# EAGLE schematic gardtec (EAGLE 9.6.2)
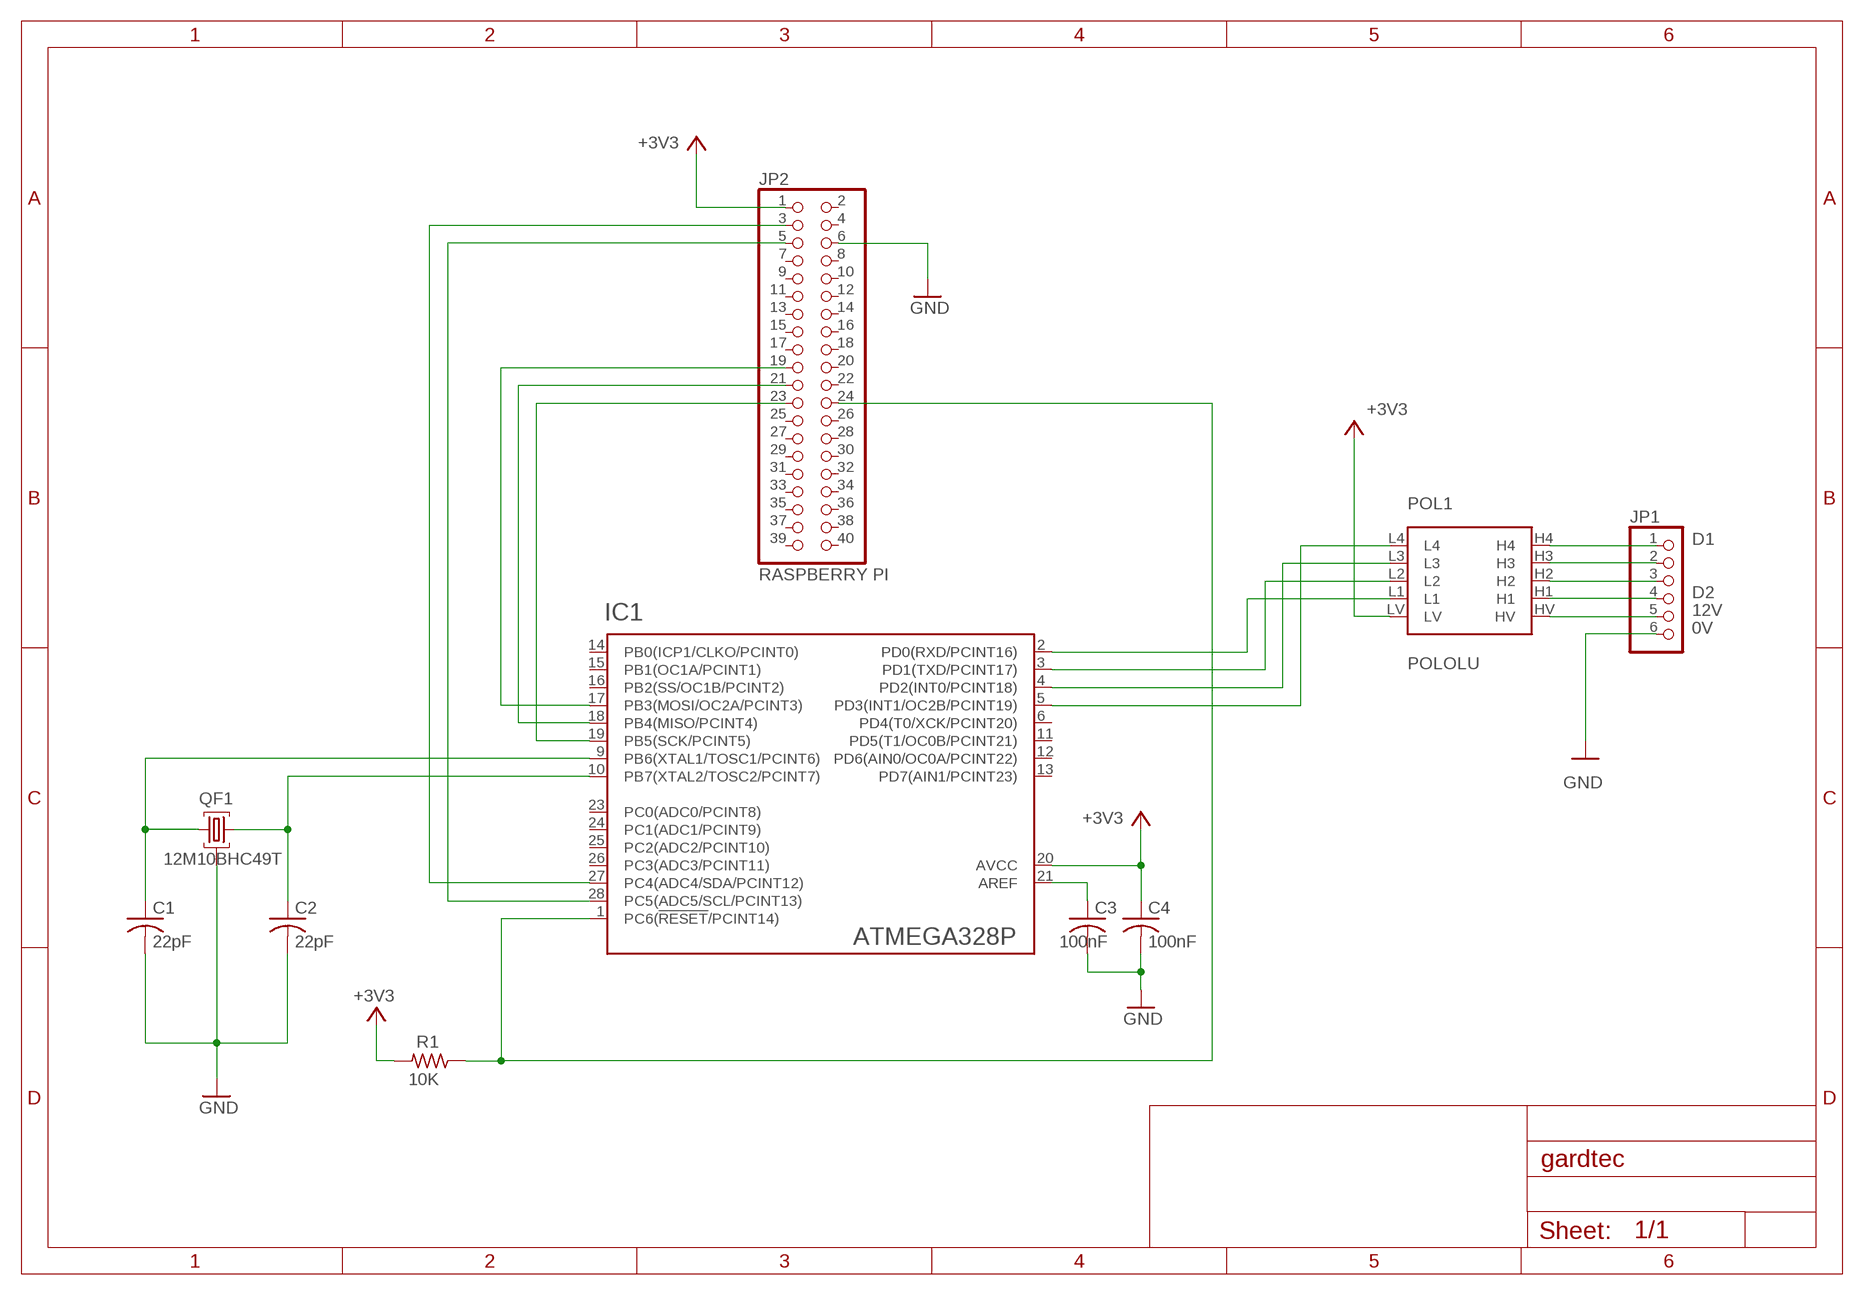
[diagram p0: schematic, sheet 1]

## Parts
C1  22pF  C-USC0805  [C0805]
C2  22pF  C-USC0805  [C0805]
C3  100nF  C-USC0805  [C0805]
C4  100nF  C-USC0805  [C0805]
IC1  ATMEGA328P  ATMEGA48/88/168/328-PU(DIP28)PU  [DIL28]
JP1  PINHD-1X6  [1X06]
JP2  RASPBERRY PI  PINHD-2X20  [2X20]
POL1  POLOLU  [POLOLU]
QF1  12M10BHC49T  [HC49U]
R1  10K  R-US_R0805  [R0805]

## Nets
0V: C1.2 C2.2 C3.2 C4.2 JP1.6 QF1.2 ; supply symbol labelled GND
12V: JP1.5 POL1.HV
+3V3: C4.1 IC1.20(AVCC) JP2.1 POL1.LV R1.2
D1: JP1.1 POL1.H4
D2: JP1.4 POL1.H1
GND: JP2.6
N$1: IC1.2(PD0(RXD/PCINT16)) POL1.L1
N$2: IC1.3(PD1(TXD/PCINT17)) POL1.L2
N$3: IC1.4(PD2(INT0/PCINT18)) POL1.L3
N$4: IC1.5(PD3(INT1/OC2B/PCINT19)) POL1.L4
N$5: C3.1 IC1.21(AREF)
N$7: C1.1 IC1.9(PB6(XTAL1/TOSC1/PCINT6)) QF1.1
N$8: C2.1 IC1.10(PB7(XTAL2/TOSC2/PCINT7)) QF1.3
N$9: IC1.1(PC6(!RESET!/PCINT14)) JP2.24 R1.1
N$11: JP1.2 POL1.H3
N$17: IC1.27(PC4(ADC4/SDA/PCINT12)) JP2.3
N$18: IC1.28(PC5(ADC5/SCL/PCINT13)) JP2.5
N$28: IC1.17(PB3(MOSI/OC2A/PCINT3)) JP2.19
N$29: IC1.19(PB5(SCK/PCINT5)) JP2.23
N$30: IC1.18(PB4(MISO/PCINT4)) JP2.21
N/C: JP1.3 POL1.H2
Unconnected: IC1.6(PD4(T0/XCK/PCINT20)) IC1.11(PD5(T1/OC0B/PCINT21)) IC1.12(PD6(AIN0/OC0A/PCINT22)) IC1.13(PD7(AIN1/PCINT23)) IC1.14(PB0(ICP1/CLKO/PCINT0)) IC1.15(PB1(OC1A/PCINT1)) IC1.16(PB2(SS/OC1B/PCINT2)) IC1.23(PC0(ADC0/PCINT8)) IC1.24(PC1(ADC1/PCINT9)) IC1.25(PC2(ADC2/PCINT10)) IC1.26(PC3(ADC3/PCINT11)) JP2.2 JP2.4 JP2.7 JP2.8 JP2.9 JP2.10 JP2.11 JP2.12 JP2.13 JP2.14 JP2.15 JP2.16 JP2.17 JP2.18 JP2.20 JP2.22 JP2.25 JP2.26 JP2.27 JP2.28 JP2.29 JP2.30 JP2.31 JP2.32 JP2.33 JP2.34 JP2.35 JP2.36 JP2.37 JP2.38 JP2.39 JP2.40

## Power pins joined to a net without a drawn wire
GND: IC1.8(GND) IC1.22(GND)
UCC: IC1.7(UCC)

## Library data of the parts
C1-C4 = rcl:C-US: CAPACITOR, American symbol; SPICEPREFIX: C
IC1 = atmel_tiny24-44-84tiny48-88mega48-88-168-328:ATMEGA48/88/168/328-PU(DIP28)
JP1 = pinhead:PINHD-1X6: PIN HEADER
JP2 = pinhead:PINHD-2X20: PIN HEADER
POL1 = level-shifter2:POLOLU
QF1 = crystal:12M10BHC49T: Monolithic Crystal Filters Source: www.vanlong.com; OC_FARNELL: unknown; OC_NEWARK: unknown
R1 = rcl:R-US_: RESISTOR, American symbol; SPICEPREFIX: R